# EAGLE design communications_hub2 (EAGLE 9.3.0)
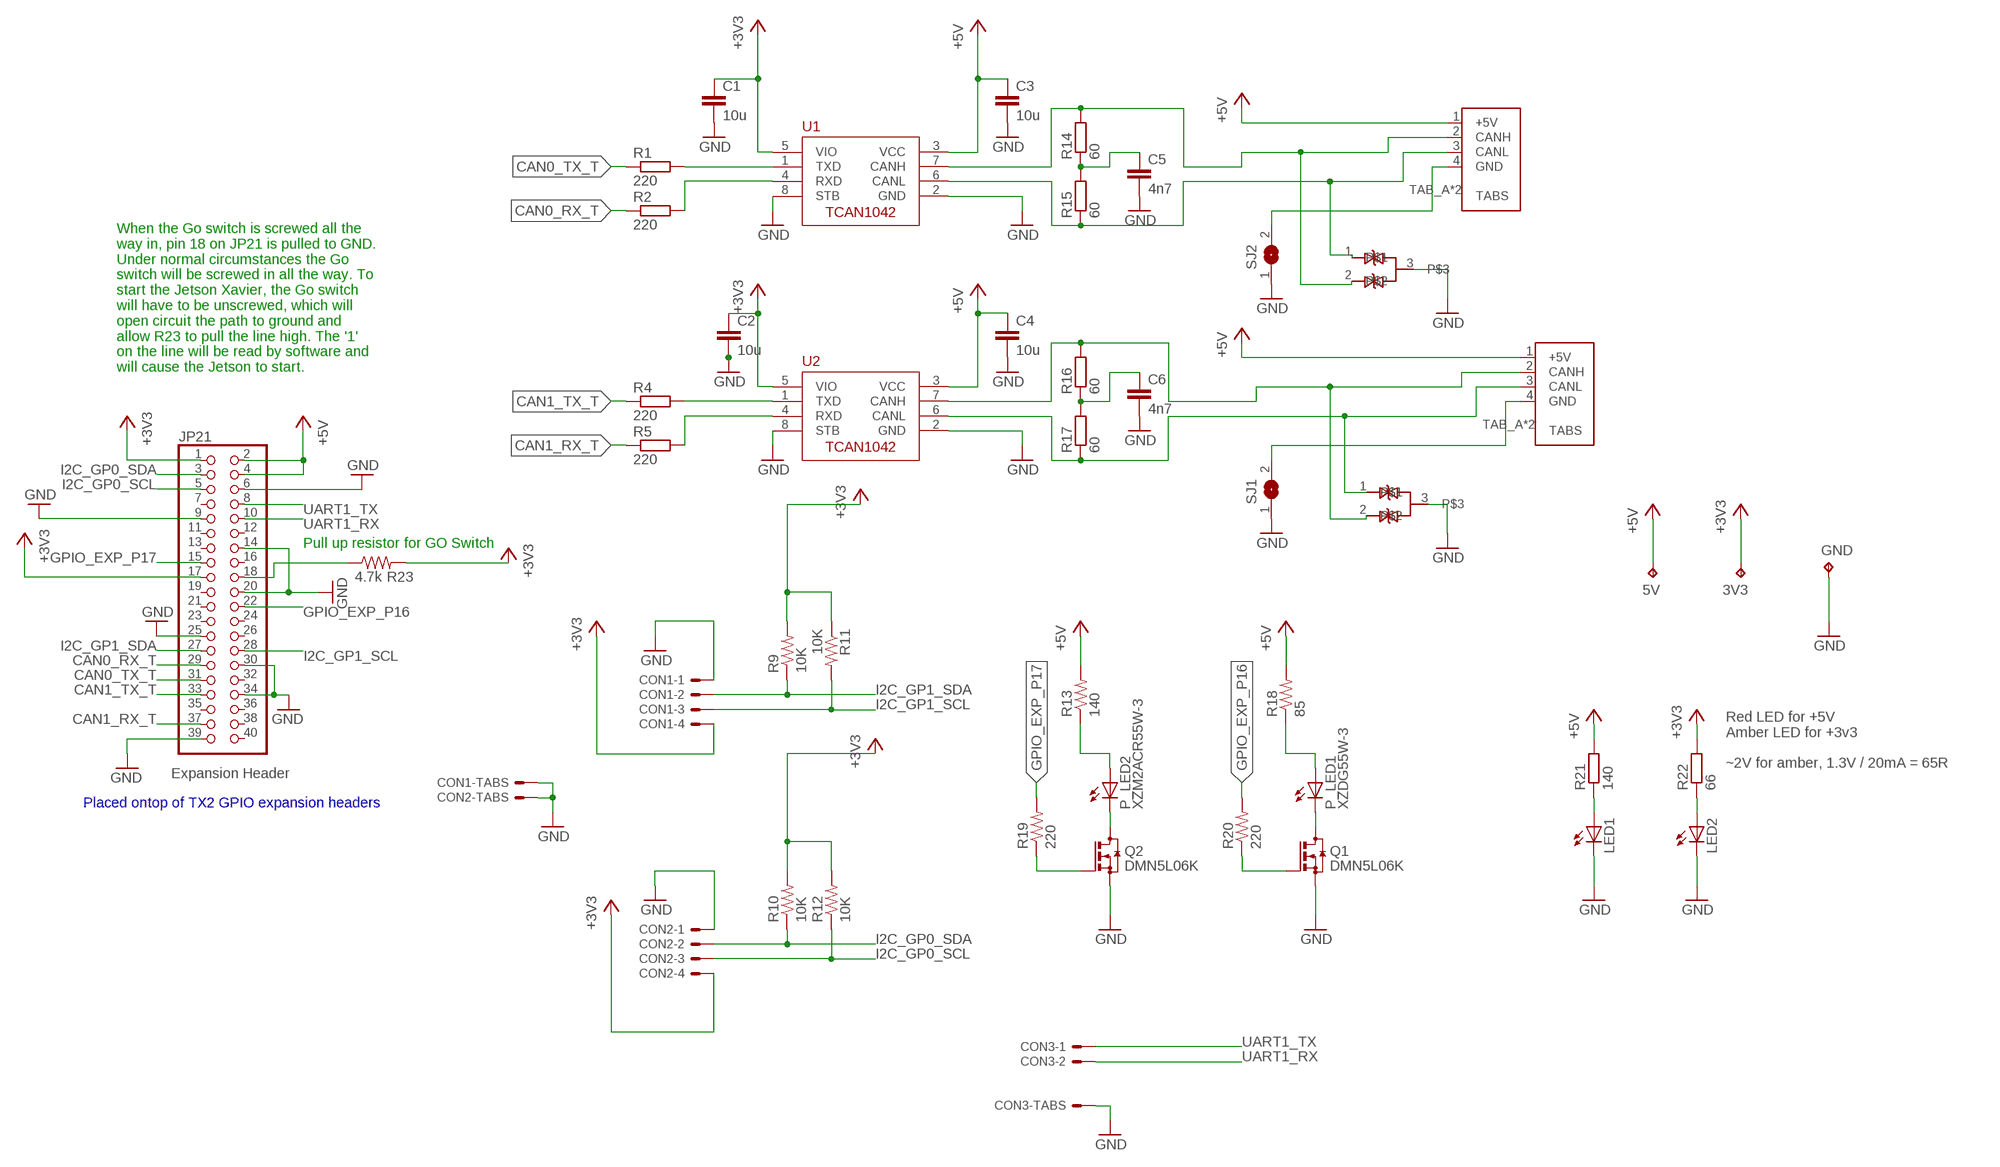
[diagram p0: schematic, sheet 1]

## Parts
3V3  TPB2,54  [B2,54]
5V  TPB2,54  [B2,54]
C1  10u  C-EUC0805  [C0805]
C2  10u  C-EUC0805  [C0805]
C3  10u  C-EUC0805  [C0805]
C4  10u  C-EUC0805  [C0805]
C5  4n7  C-EUC0805  [C0805]
C6  4n7  C-EUC0805  [C0805]
CON1  SM04B-GHS-TB  [SM04B-GHS-TB]
CON2  SM04B-GHS-TB  [SM04B-GHS-TB]
CON3  SM02B-GHS-TB  [SM02B-GHS-TB]
CON6  UAVCAN_MICRO  [SM04B-GHS-TB]
CON7  UAVCAN_MICRO  [SM04B-GHS-TB]
GND  TPB2,54  [B2,54]
JP21  PINHD-2X20  [2X20]
LED1  LEDSMT1206  [1206]
LED2  LEDSMT1206  [1206]
P_LED1  XZDG55W-3  LED_E  [LED_1206]
P_LED2  XZM2ACR55W-3  LED_E  [LED_1206]
Q1  DMN5L06K  BSS123  [SOT23]
Q2  DMN5L06K  BSS123  [SOT23]
R1  220  R-EU_R0805  [R0805]
R2  220  R-EU_R0805  [R0805]
R4  220  R-EU_R0805  [R0805]
R5  220  R-EU_R0805  [R0805]
R9  10K  R-US_M1206  [M1206]
R10  10K  R-US_M1206  [M1206]
R11  10K  R-US_M1206  [M1206]
R12  10K  R-US_M1206  [M1206]
R13  140  R-US_M1206  [M1206]
R14  60  R-EU_R1206  [R1206]
R15  60  R-EU_R1206  [R1206]
R16  60  R-EU_R1206  [R1206]
R17  60  R-EU_R1206  [R1206]
R18  85  R-US_M1206  [M1206]
R19  220  R-US_R0805  [R0805]
R20  220  R-US_R0805  [R0805]
R21  140  R-EU_R0805  [R0805]
R22  66  R-EU_R0805  [R0805]
R23  4.7k  R-US_R0603  [R0603]
SJ1  SJ  [SJ]
SJ2  SJ  [SJ]
U1  TCAN1042HVDR  [SO-8]
U2  TCAN1042HVDR  [SO-8]
U$4  NUP2105L  [SOT23]
U$5  NUP2105L  [SOT23]

## Nets
+3V3: 3V3.TP C1.1 C2.1 CON1.P$4 CON2.P$4 JP21.1 JP21.17 R9.2 R10.2 R11.1 R12.2 R22.2 R23.2 U1.5(VIO) U2.5(VIO)
+5V: 5V.TP C3.1 C4.1 CON6.1(+5V) CON7.1(+5V) JP21.2 JP21.4 R13.2 R18.2 R21.2 U1.3(VCC) U2.3(VCC)
CAN0_RX_T: JP21.29 R2.1
CAN0_TX_T: JP21.31 R1.1
CAN1_RX_T: JP21.37 R5.1
CAN1_TX_T: JP21.33 R4.1
GND: C1.2 C2.2 C3.2 C4.2 C5.2 C6.2 CON1.P$1 CON1.P$5 CON1.P$6 CON2.P$1 CON2.P$5 CON2.P$6 CON3.P$3 CON3.P$4 GND.TP JP21.6 JP21.9 JP21.14 JP21.20 JP21.25 JP21.30 JP21.34 JP21.39 LED1.C LED2.C Q1.2(S) Q2.2(S) SJ1.1 SJ2.1 U1.2(GND) U1.8(STB) U2.2(GND) U2.8(STB) U$4.3 U$5.3
GPIO_EXP_P16: JP21.22 R20.2
GPIO_EXP_P17: JP21.15 R19.2
I2C_GP0_SCL: CON2.P$3 JP21.5 R12.1
I2C_GP0_SDA: CON2.P$2 JP21.3 R10.1
I2C_GP1_SCL: CON1.P$3 JP21.28 R11.2
I2C_GP1_SDA: CON1.P$2 JP21.27 R9.1
N$1: JP21.18 R23.1
N$3: P_LED2.A R13.1
N$4: P_LED1.A R18.1
N$7: CON7.4(GND) SJ1.2
N$8: CON6.4(GND) SJ2.2
N$9: P_LED2.C Q2.3(D)
N$10: P_LED1.C Q1.3(D)
N$11: Q2.1(G) R19.1
N$12: Q1.1(G) R20.1
N$13: LED1.A R21.1
N$14: LED2.A R22.1
N$19: C5.1 R14.1 R15.2
N$20: C6.1 R16.1 R17.2
N$21: CON7.2(CANH) R16.2 U2.7(CANH) U$5.2
N$22: CON7.3(CANL) R17.1 U2.6(CANL) U$5.1
N$23: CON6.2(CANH) R14.2 U1.7(CANH) U$4.2
N$24: CON6.3(CANL) R15.1 U1.6(CANL) U$4.1
N$25: R1.2 U1.1(TXD)
N$26: R2.2 U1.4(RXD)
N$28: R4.2 U2.1(TXD)
N$29: R5.2 U2.4(RXD)
UART1_RX: CON3.P$2 JP21.10
UART1_TX: CON3.P$1 JP21.8
Unconnected: CON6.TAB_A(TABS) CON6.TAB_B(TABS) CON7.TAB_A(TABS) CON7.TAB_B(TABS) JP21.7 JP21.11 JP21.12 JP21.13 JP21.16 JP21.19 JP21.21 JP21.23 JP21.24 JP21.26 JP21.32 JP21.35 JP21.36 JP21.38 JP21.40

## Notes on the sheet
- When the Go switch is screwed all the
   way in, pin 18 on JP21 is pulled to GND.
   Under normal circumstances the Go
   switch will be screwed in all the way. To
   start the Jetson Xavier, the Go switch
   will have to be unscrewed, which will
   open circuit the path to ground and
   allow R23 to pull the line high. The '1'
   on the line will be read by software and
   will cause the Jetson to start.
- Pull up resistor for GO Switch
- Expansion Header
- Red LED for +5V
  Amber LED for +3v3
  
  ~2V for amber, 1.3V / 20mA = 65R
- Placed ontop of TX2 GPIO expansion headers

## Library data of the parts
3V3 5V GND = testpad:TP: Test pad
C1-C6 = resistor:C-EU: CAPACITOR, European symbol
CON1 CON2 = ARVP:SM04B-GHS-TB
CON3 = ARVP:SM02B-GHS-TB
CON6 CON7 = SPEAR-general:UAVCAN_MICRO: CAN Bus Standard Connector
JP21 = commhub:PINHD-2X20: PIN HEADER
LED1 LED2 = led:LED: LED OSRAM: - CHIPLED LG R971, LG N971, LY N971, LG Q971, LY Q971, LO R971, LY R971 LH N974, LH R974 LS Q976, LO Q976, LY Q976 LO Q996 - Hyper CHIPLED LW Q18S LB Q993, LB Q99A, LB R99A - SideLED LS A670, LO A670, LY A670, LG A670, LP A670 LB A673, LV A673, LT A673, LW A673 LH A674 LY A675 LS A676, LA A676, LO A676, LY A676, LW A676 LS A679, LY A679, LG A679 - Hyper Micro SIDELED® LS Y876, LA Y876, LO Y876, LY Y876 LT Y87S - SmartLED LW L88C, LW L88S LB L89C, LB L89S, LG L890 LS L89K, LO L89K, LY L89K LS L896, LA L896, LO L896, LY L896 - TOPLED LS T670, LO T670, LY T670, LG T670, LP T670 LSG T670, LSP T670, LSY T670, LOP T670, LYG T670 LG T671, LOG T671, LSG T671 LB T673, LV T673, LT T673, LW T673 LH T674 LS T676, LA T676, LO T676, LY T676, LB T676, LH T676, LSB T676, LW T676 LB T67C, LV T67C, LT T67C, LS T67K, LO T67K, LY T67K, LW E67C LS E67B, LA E67B, LO E67B, LY E67B, LB E67C, LV E67C, LT E67C LW T67C LS T679, LY T679, LG T679 LS T770, LO T770, LY T770, LG T770, LP T770 LB T773, LV T773, LT T773, LW T773 LH T774 LS E675, LA E675, LY E675, LS T675 LS T776, LA T776, LO T776, LY T776, LB T776 LHGB T686 LT T68C, LB T68C - Hyper Mini TOPLED® LB M676 - Mini TOPLED Santana® LG M470 LS M47K, LO M47K, LY M47K Source: http://www.osram.convergy.de LUXEON: - LUMILED® LXK2-PW12-R00, LXK2-PW12-S00, LXK2-PW14-U00, LXK2-PW14-V00 LXK2-PM12-R00, LXK2-PM12-S00, LXK2-PM14-U00 LXK2-PE12-Q00, LXK2-PE12-R00, LXK2-PE12-S00, LXK2-PE14-T00, LXK2-PE14-U00 LXK2-PB12-K00, LXK2-PB12-L00, LXK2-PB12-M00, LXK2-PB14-N00, LXK2-PB14-P00, LXK2-PB14-Q00 LXK2-PR12-L00, LXK2-PR12-M00, LXK2-PR14-Q00, LXK2-PR14-R00 LXK2-PD12-Q00, LXK2-PD12-R00, LXK2-PD12-S00 LXK2-PH12-R00, LXK2-PH12-S00 LXK2-PL12-P00, LXK2-PL12-Q00, LXK2-PL12-R00 Source: www.luxeon.com KINGBRIGHT: KA-3528ASYC Source: www.kingbright.com
P_LED1 P_LED2 = eagle-ltspice:LED_E: LED Source: http://www.osram.convergy.de Source: www.luxeon.com Source: www.kingbright.com; SPICEMODEL: NONE; SPICEPREFIX: D; SPICETYPE: diode
Q1 Q2 = transistor-small-signal:BSS123: N-CHANNEL MOS FET
R1 R2 R4 R5 R14-R17 R21 R22 = resistor:R-EU_: RESISTOR, European symbol
R9-R13 R18 = resistor:R-US_: RESISTOR, American symbol
R19 R20 = rcl:R-US_: RESISTOR, American symbol
R23 = audio amplifier example:R-US_: RESISTOR, American symbol
SJ1 SJ2 = jumper:SJ: SMD solder JUMPER
U1 U2 = ARVP:TCAN1042HVDR
U$4 U$5 = ARVP:NUP2105L

## Board
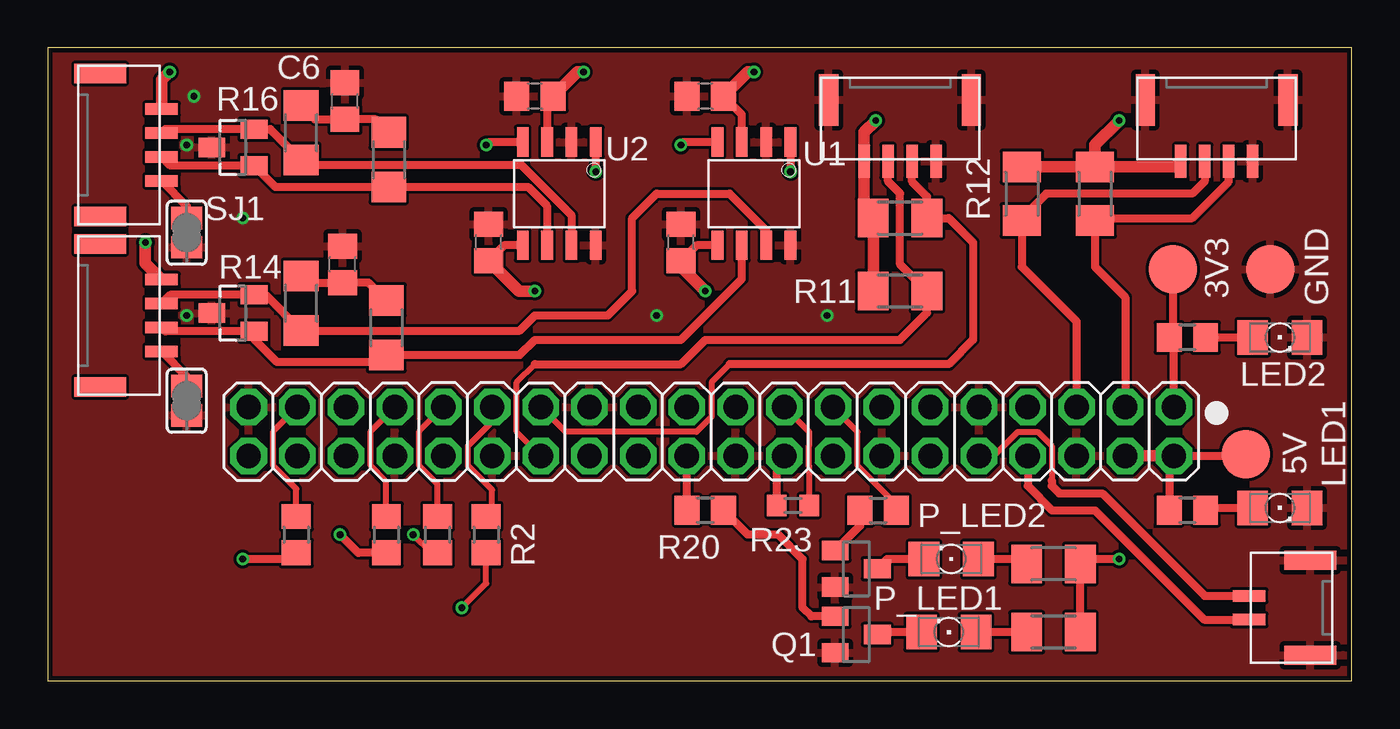
[diagram p1: board, top side]
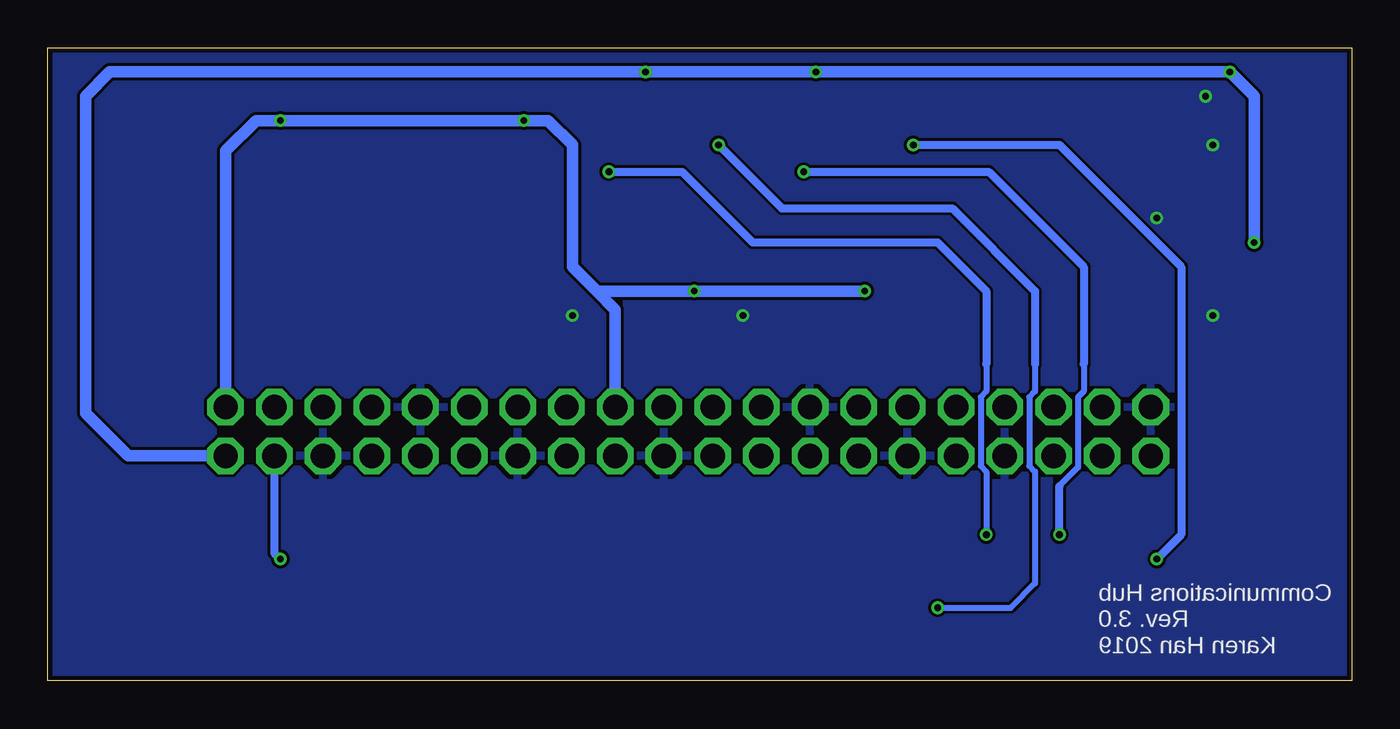
[diagram p2: board, bottom side, seen from below]

Size 68 x 33 mm. Coordinates in mm from the lower left corner, seen from the top.
Outline: 0,0 68,0 68,33 0,33 0,0
Copper layers (1*16): Top 0.035mm / dielectric 1.5mm / Bottom 0.035mm
Design rules "JLCPCB2Layer": minimum track width 6mil, minimum drill 10mil, track to track 6mil, track to pad 6mil, pad to pad 6mil, via to via 6mil, smd to smd 0mil, copper to edge 10mil, drill to drill 10mil, minimum pad ring 6mil, minimum via ring 6mil, stop-mask expansion 2mil, vias tented up to drill 100mil, thermal gap 10mil

### Footprints (pad centres in the part's own frame; a part is rotated, then mirrored left to right if it is on the bottom)
B2,54 = smd 2.54 x 2.54: TP 0,0
C0805 = smd 1.3 x 1.5: 1 -0.95,0; 2 0.95,0
SM04B-GHS-TB = smd 0.6 x 1.7: P$1 -1.875,0.85; P$2 -0.625,0.85; P$3 0.625,0.85; P$4 1.875,0.85 | smd 1 x 2.7: P$5 -3.725,-2.35; P$6 3.725,-2.35
SM02B-GHS-TB = smd 0.6 x 1.7: P$1 -0.625,0.85; P$2 0.625,0.85 | smd 1 x 2.7: P$3 -2.475,-2.35; P$4 2.475,-2.35
SM04B-GHS-TB' = smd 0.6 x 1.7: 1 -1.875,0.85; 2 -0.625,0.85; 3 0.625,0.85; 4 1.875,0.85 | smd 1 x 2.7: TAB_A -3.725,-2.35; TAB_B 3.725,-2.35
2X20 = drill 1.27 octagon: 1 -24.13,-1.27; 2 -24.13,1.27; 3 -21.59,-1.27; 4 -21.59,1.27; 5 -19.05,-1.27; 6 -19.05,1.27; 7 -16.51,-1.27; 8 -16.51,1.27; 9 -13.97,-1.27; 10 -13.97,1.27; 11 -11.43,-1.27; 12 -11.43,1.27; 13 -8.89,-1.27; 14 -8.89,1.27; 15 -6.35,-1.27; 16 -6.35,1.27; 17 -3.81,-1.27; 18 -3.81,1.27; 19 -1.27,-1.27; 20 -1.27,1.27; 21 1.27,-1.27; 22 1.27,1.27; 23 3.81,-1.27; 24 3.81,1.27; 25 6.35,-1.27; 26 6.35,1.27; 27 8.89,-1.27; 28 8.89,1.27; 29 11.43,-1.27; 30 11.43,1.27; 31 13.97,-1.27; 32 13.97,1.27; 33 16.51,-1.27; 34 16.51,1.27; 35 19.05,-1.27; 36 19.05,1.27; 37 21.59,-1.27; 38 21.59,1.27; 39 24.13,-1.27; 40 24.13,1.27
1206 = smd 1.6 x 1.803: A -1.422,0; C 1.422,0
LED_1206 = smd 1.6 x 1.803: A -1.422,0; C 1.422,0
SOT23 = smd 1 x 1.4: 1 -0.95,-1.1; 2 0.95,-1.1; 3 0,1.1
R0805 = smd 1.3 x 1.5: 1 -0.95,0; 2 0.95,0
M1206 = smd 1.6 x 2: 1 -1.4,0; 2 1.4,0
R1206 = smd 1.6 x 1.803: 1 -1.422,0; 2 1.422,0
R0603 = smd 1 x 1.1: 1 -0.85,0; 2 0.85,0
SJ = smd 1.168 x 1.6: 1 -0.762,0; 2 0.762,0
SO-8 = smd 1.524 x 0.61: 1 -2.692,1.905; 2 -2.692,0.635; 3 -2.692,-0.635; 4 -2.692,-1.905; 5 2.692,-1.905; 6 2.692,-0.635; 7 2.692,0.635; 8 2.692,1.905

### Placement (x,y rotation side)
3V3  58.67,21.46 270 top
5V  62.48,11.81 270 top
C1  33.02,22.86 90 top
C2  22.99,22.86 90 top
C3  34.29,30.48 180 top
C4  25.4,30.48 180 top
C5  15.37,21.72 90 top
C6  15.49,30.23 90 top
CON1  44.45,27.94 180 top
CON2  60.96,27.94 180 top
CON3  63.5,3.81 90 top
CON6  UAVCAN_MICRO  [SM04B-GHS-TB']  5.08,19.05 270 top
CON7  UAVCAN_MICRO  [SM04B-GHS-TB']  5.08,27.94 270 top
GND  63.75,21.46 270 top
JP21  34.6,13 180 top
LED1  64.26,9.02 0 top
LED2  64.26,17.91 0 top
P_LED1  46.99,2.54 180 top
P_LED2  47.12,6.35 180 top
Q1  42.16,2.41 270 top
Q2  42.16,5.84 270 top
R1  20.32,7.62 270 top
R2  22.86,7.62 270 top
R4  17.65,7.62 270 top
R5  12.95,7.62 270 top
R9  44.45,24.13 180 top
R10  54.61,25.4 90 top
R11  44.45,20.32 0 top
R12  50.8,25.4 90 top
R13  52.45,6.1 0 top
R14  13.21,19.68 270 top
R15  17.65,18.41 90 top
R16  13.21,28.57 270 top
R17  17.78,27.18 90 top
R18  52.45,2.54 0 top
R19  43.31,8.89 0 top
R20  34.29,8.89 180 top
R21  59.44,8.89 180 top
R22  59.44,17.91 180 top
R23  38.86,9.14 0 top
SJ1  7.24,23.37 90 top
SJ2  7.24,14.61 90 top
U1  36.83,25.4 270 top
U2  26.67,25.4 270 top
U$4  9.65,19.18 90 top
U$5  9.65,27.81 90 top

### Tracks (layer width: path | path; a pad name or v marks a point on that pad's centre or on a via)
+3V3  (via drill 0.35)
  Top 0.305: JP21.17 39.71,12.97 39.71,12.27 39.69,12.25 39.69,11.21 39.71,11.19 R23.2
  Top 0.406: JP21.1 58.73,17.66 R22.2 58.67,18.09 3V3.TP | U1.5 33.82,22.71 C1.1 | U2.5 23.79,22.71 C2.1
  Top 0.61: R12.2 R10.2 | R10.2 58.8,26.8 CON2.P$4 | R11.1 R9.2 42.58,24.61 CON1.P$4 42.58,28.61 v43.18,29.21 | R10.2 54.61,27.94 v55.88,29.21 | C1.1 33.02,21.59 v34.29,20.32 | C2.1 24.58,20.32 v25.4,20.32
  Bottom 0.61: JP21.1 58.73,27.63 57.15,29.21 v55.88,29.21 v43.18,29.21 41.91,29.21 40.64,27.94 40.64,21.59 39.37,20.32 | 39.37,20.32 v34.29,20.32 v25.4,20.32 | 39.37,20.32 38.41,19.36 JP21.17
+5V  (via drill 0.35)
  Top 0.406: R21.2 58.49,11.49 JP21.2 62.4,11.73 5V.TP | R18.2 R13.2 54.1,6.35 v55.88,6.35 | C4.1 26.04,30.16 U2.3 | U1.3 36.2,29.52 C3.1
  Top 0.61: CON7.1 5.93,31.33 v6.35,31.75 | CON6.1 5.08,21.77 v5.08,22.86 | JP21.2 JP21.4 | C4.1 27.62,31.75 v27.94,31.75 | C3.1 36.51,31.75 v36.83,31.75
  Bottom 0.406: JP21.4 56.19,6.66 v55.88,6.35
  Bottom 0.61: JP21.2 63.81,11.73 66.04,13.96 66.04,30.48 64.77,31.75 v36.83,31.75 v27.94,31.75 v6.35,31.75 5.08,30.48 v5.08,22.86
CAN0_RX_T
  Top 0.305: R2.1 23.17,8.88 23.17,9.95 21.91,11.21 21.91,12.25 23.17,13.51 JP21.29
CAN0_TX_T
  Top 0.305: R1.1 20.32,10.26 19.37,11.21 19.37,13.01 JP21.31
CAN1_RX_T
  Top 0.305: R5.1 12.95,10.01 11.75,11.21 11.75,13.01 JP21.37
CAN1_TX_T
  Top 0.305: R4.1 17.65,10.39 16.83,11.21 16.83,13.01 JP21.33
GND  (via drill 0.35)
  other vias: 10.16,24.13 7.62,30.48 40.64,19.05 7.24,19.05 7.24,27.94 31.75,19.05
  pour Top: 0,33.02 0,0 68.07,0 68.07,33.02
  pour Bottom: 0,33.02 0,0 68.07,0 68.07,33.02
GPIO_EXP_P16
  Top 0.406: R20.2 JP21.22
GPIO_EXP_P17
  Top 0.305: R19.2 44.26,9.19 42.23,11.21 42.23,12.99 JP21.15
I2C_GP0_SCL
  Top 0.406: CON2.P$3 60.34,26.05 59.69,25.4 52.07,25.4 50.8,24.13 R12.1 50.8,21.59 53.65,18.74 JP21.5
I2C_GP0_SDA
  Top 0.406: CON2.P$2 61.59,26.02 59.69,24.13 54.74,24.13 R10.1 54.61,21.59 56.19,20.01 JP21.3
I2C_GP1_SCL
  Top 0.305: JP21.28 24.45,12.99 24.45,15.56 25.4,16.51
  Top 0.406: CON1.P$3 43.83,26.05 44.45,25.42 44.45,21.72 R11.2 45.85,19.18 44.45,17.78 34.29,17.78 33.02,16.51 25.4,16.51
I2C_GP1_SDA
  Top 0.305: 35.56,16.51 34.61,15.56 34.61,13.78 33.83,12.99 26.99,12.99 JP21.27
  Top 0.406: CON1.P$2 45.08,26.02 45.85,25.25 R9.1 46.99,24.13 48.26,22.86 48.26,17.78 46.99,16.51 35.56,16.51
N$1
  Top 0.406: JP21.18 38.01,11.33 R23.1
N$3
  Top 0.406: R13.1 50.8,6.35 P_LED2.A
N$4
  Top 0.406: R18.1 P_LED1.A
N$7
  Top 0.406: CON7.4 7.24,24.76 SJ1.2
N$8
  Top 0.406: CON6.4 7.24,15.87 SJ2.2
N$9
  Top 0.406: P_LED2.C 43.77,6.35 Q2.3
N$10
  Top 0.406: P_LED1.C 43.39,2.54 Q1.3
N$11
  Top 0.406: Q2.1 42.36,8.09 R19.1
N$12
  Top 0.406: R20.1 36.51,7.62 38.1,7.62 39.37,6.35 39.37,3.81 39.82,3.36 Q1.1
N$13
  Top 0.406: R21.1 60.51,9.02 LED1.A
N$14
  Top 0.406: R22.1 LED2.A
N$19
  Top 0.406: R14.1 13.55,20.77 C5.1 16.72,20.77 R15.2
N$20
  Top 0.406: R16.1 13.93,29.28 C6.1 17.1,29.28 R17.2
N$21
  Top 0.406: CON7.2 6.13,28.76 U$5.2 11.6,28.76 R16.2 13.45,26.91 24.68,26.91 27.3,24.29 U2.7
N$22
  Top 0.406: CON7.3 6.38,26.86 U$5.1 11.86,25.76 R17.1 25.04,25.76 26.04,24.77 U2.6
N$23
  Top 0.406: CON6.2 6.38,20.13 U$4.2 11.34,20.13 R14.2 24.61,18.26 25.4,19.05 29.21,19.05 30.48,20.32 30.48,24.13 31.75,25.4 35.56,25.4 37.47,23.5 U1.7
N$24
  Top 0.406: CON6.3 6.13,18.23 U$4.1 10.75,17.82 11.94,16.64 17.3,16.64 R15.1 24.61,16.99 25.4,17.78 33.02,17.78 36.2,20.95 U1.6
N$25  (via drill 0.35)
  Top 0.305: R1.2 20,6.67 v19.05,7.62
  Top 0.406: U1.1 v38.73,26.54
  Bottom 0.305: 19.05,16.51 19.05,15.09 19.35,14.79 19.35,11.21 19.05,10.91 v19.05,7.62
  Bottom 0.406: v38.73,26.54 34.92,26.54 31.24,22.86 21.59,22.86 19.05,20.32 19.05,16.51
N$26  (via drill 0.35)
  Top 0.305: v21.59,3.81 22.86,5.08 R2.2
  Top 0.406: U1.4 33.17,28.09 v33.02,27.94
  Bottom 0.305: 16.51,16.51 16.51,15.09 16.81,14.79 16.81,11.21 16.51,10.91 16.51,5.08 17.78,3.81 v21.59,3.81
  Bottom 0.406: v33.02,27.94 29.72,24.64 20.83,24.64 16.51,20.32 16.51,16.51
N$28  (via drill 0.35)
  Top 0.406: R4.2 16.19,6.67 v15.24,7.62 | U2.1 v28.57,26.54
  Bottom 0.305: 15.24,10.16 14.27,11.13 14.27,14.79 13.97,15.09 13.97,16.51
  Bottom 0.406: v15.24,7.62 15.24,10.16 | v28.57,26.54 18.92,26.54 13.97,21.59 13.97,16.51
N$29  (via drill 0.35)
  Top 0.406: R5.2 12.63,6.35 v10.16,6.35 | U2.4 23.01,28.09 v22.86,27.94
  Bottom 0.406: v10.16,6.35 8.89,7.62 8.89,21.59 15.24,27.94 v22.86,27.94
UART1_RX
  Top 0.305: JP21.10 49.33,11.73 50.59,12.99 51.63,12.99 52.37,12.25 52.37,10.46
  Top 0.406: 52.37,10.46 52.37,10.16 52.75,9.78 54.99,9.78 60.34,4.43 CON3.P$2
UART1_TX
  Top 0.406: JP21.8 51.11,10.16 52.38,8.89 54.61,8.89 55.88,7.62 60.31,3.19 CON3.P$1

### Text on the board
bNames: Communications Hub / Rev. 3.0 / Karen Han 2019
Document: TOP | Tray